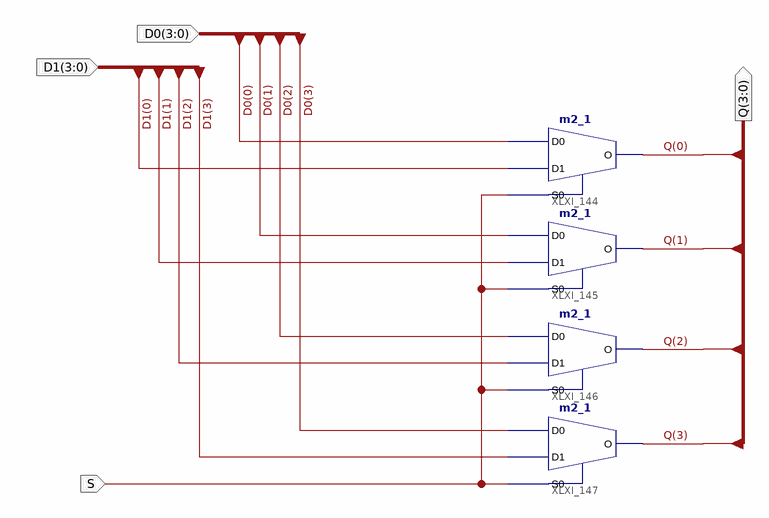
[diagram p0: schematic sheet 1]
// Xilinx ISE schematic mux2x1x4.sch (spartan6) as structural Verilog: 4 symbols, 4 ports
module mux2x1x4 (
  input  [3:0] D0,
  input  [3:0] D1,
  input  S,
  output [3:0] Q
);

  m2_1 XLXI_144 (.D0(D0[0]), .D1(D1[0]), .S0(S), .O(Q[0]));
  m2_1 XLXI_145 (.D0(D0[1]), .D1(D1[1]), .S0(S), .O(Q[1]));
  m2_1 XLXI_146 (.D0(D0[2]), .D1(D1[2]), .S0(S), .O(Q[2]));
  m2_1 XLXI_147 (.D0(D0[3]), .D1(D1[3]), .S0(S), .O(Q[3]));
endmodule
